# Altium project Fungnator.PrjPcb
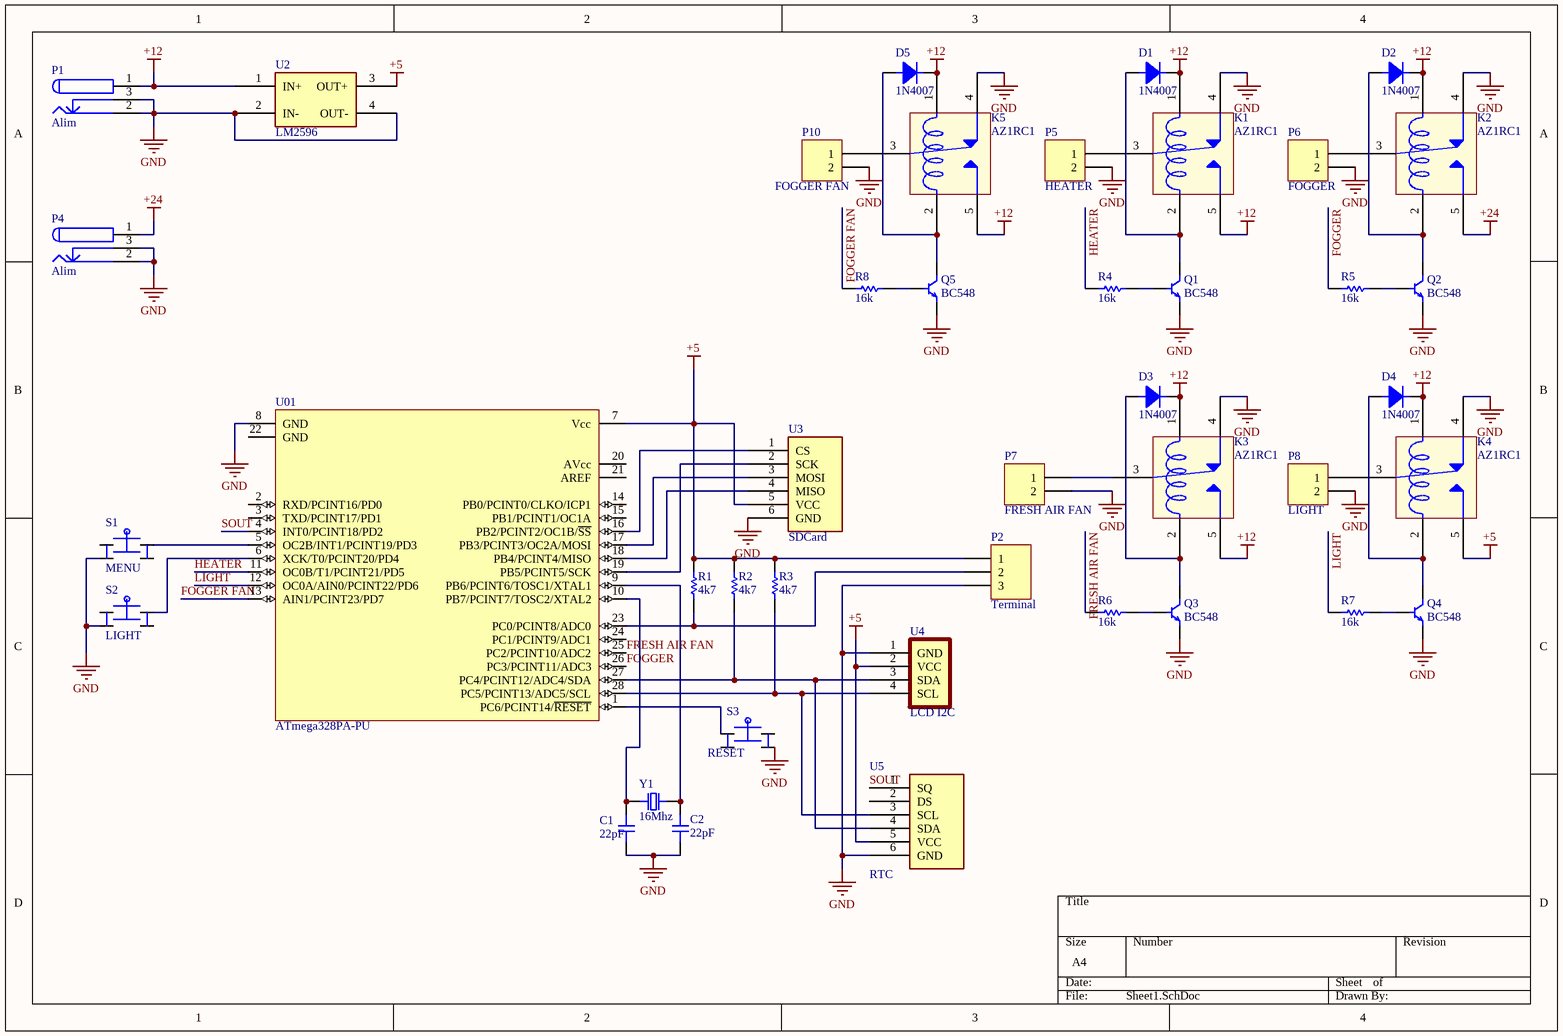
[diagram p0: Sheet1.SchDoc]
1 sheet, 42 parts. Net scope: global (net labels, ports and power ports of the same name join across sheets).
Board file: PCB1.PcbDoc

## Sheet Sheet1.SchDoc
size A4

### Parts
C1  22pF  [C100-200-100]
C2  22pF  [C100-200-100]
D1  1N4007  [DO-41-Plastic]
D2  1N4007  [DO-41-Plastic]
D3  1N4007  [DO-41-Plastic]
D4  1N4007  [DO-41-Plastic]
D5  1N4007  [DO-41-Plastic]
K1  AZ1RC1  [Relay-A]
K2  AZ1RC1  [Relay-A]
K3  AZ1RC1  [Relay-A]
K4  AZ1RC1  [Relay-A]
K5  AZ1RC1  [Relay-A]
P1  Alim  [J4-DC-005]
P2  Terminal  [KRE_3]
P4  Alim  [J4-DC-005]
P5  HEATER  [KRE_2]
P6  FOGGER  [KRE_2]
P7  FRESH AIR FAN  [KRE_2]
P8  LIGHT  [KRE_2]
P10  FOGGER FAN  [KRE_2]
Q1  BC548  [TO-92/CBE]
Q2  BC548  [TO-92/CBE]
Q3  BC548  [TO-92/CBE]
Q4  BC548  [TO-92/CBE]
Q5  BC548  [TO-92/CBE]
R1  4k7  [R400-2.0mm]
R2  4k7  [R400-2.0mm]
R3  4k7  [R400-2.0mm]
R4  16k  [R400-2.0mm]
R5  16k  [R400-2.0mm]
R6  16k  [R400-2.0mm]
R7  16k  [R400-2.0mm]
R8  16k  [R400-2.0mm]
S1  MENU  [DTS-6.0mm-6.0mm-THT]
S2  LIGHT  [DTS-6.0mm-6.0mm-THT]
S3  RESET  [DTS-6.0mm-6.0mm-THT]
U01  ATmega328PA-PU  [DIP28-300(100)]
U2  LM2596  [LM2596]
U3  SDCard  [SDCard]
U4  LCD I2C  [LCD_I2C]
U5  RTC  [RTC]
Y1  16Mhz  [HC49-US-THT]

### Nets
+5: K4.5 P2.1 R1.2 R2.2 R3.2 U01.7(Vcc) U2.3(OUT+) U3.5(VCC) U4.2(VCC) U5.5(VCC)
+12: D1.K D2.K D3.K D4.K D5.K K1.1 K1.5 K2.1 K3.1 K3.5 K4.1 K5.1 K5.5 P1.1 U2.1(IN+)
+24: K2.5 P4.1
GND: C1.1 C2.1 K1.4 K2.4 K3.4 K4.4 K5.4 P1.2 P1.3 P2.3 P4.2 P4.3 P5.2 P6.2 P7.2 P8.2 P10.2 Q1.E Q2.E Q3.E Q4.E Q5.E S1.2 S2.2 S3.4 U01.8(GND) U2.2(IN-) U2.4(OUT-) U3.6(GND) U4.1(GND) U5.6(GND)
FOGGER: R5.1 U01.26(PC3/PCINT11/ADC3)
FOGGER FAN: R8.1 U01.13(AIN1/PCINT23/PD7)
FRESH AIR FAN: R6.1 U01.25(PC2/PCINT10/ADC2)
HEATER: R4.1 U01.11(OC0B/T1/PCINT21/PD5)
LIGHT: R7.1 U01.12(OC0A/AIN0/PCINT22/PD6)
SOUT: U01.4(INT0/PCINT18/PD2) U5.1(SQ)
NetC1_2: C1.2 U01.10(PB7/PCINT7/TOSC2/XTAL2) Y1.2
NetC2_2: C2.2 U01.9(PB6/PCINT6/TOSC1/XTAL1) Y1.1
NetD1_A: D1.A K1.2 Q1.C
NetD2_A: D2.A K2.2 Q2.C
NetD3_A: D3.A K3.2 Q3.C
NetD4_A: D4.A K4.2 Q4.C
NetD5_A: D5.A K5.2 Q5.C
NetK1_3: K1.3 P5.1
NetK2_3: K2.3 P6.1
NetK3_3: K3.3 P7.1
NetK4_3: K4.3 P8.1
NetK5_3: K5.3 P10.1
NetP2_2: P2.2 R1.1 U01.23(PC0/PCINT8/ADC0)
NetQ1_B: Q1.B R4.2
NetQ2_B: Q2.B R5.2
NetQ3_B: Q3.B R6.2
NetQ4_B: Q4.B R7.2
NetQ5_B: Q5.B R8.2
NetR2_1: R2.1 U01.27(PC4/PCINT12/ADC4/SDA) U4.3(SDA) U5.4(SDA)
NetR3_1: R3.1 U01.28(PC5/PCINT13/ADC5/SCL) U4.4(SCL) U5.3(SCL)
NetS1_3: S1.3 U01.5(OC2B/INT1/PCINT19/PD3)
NetS2_3: S2.3 U01.6(XCK/T0/PCINT20/PD4)
NetS3_1: S3.1 U01.1(PC6/PCINT14/~{RESET})
NetU01_16: U01.16(PB2/PCINT2/OC1B/~{SS}) U3.1(CS)
NetU01_17: U01.17(PB3/PCINT3/OC2A/MOSI) U3.3(MOSI)
NetU01_18: U01.18(PB4/PCINT4/MISO) U3.4(MISO)
NetU01_19: U01.19(PB5/PCINT5/SCK) U3.2(SCK)

Not connected (* = marked no-connect by the designer): S1 1 4; S2 1 4; S3 2 3; U01 2(RXD/PCINT16/PD0) 3(TXD/PCINT17/PD1) 14(PB0/PCINT0/CLKO/ICP1) 15(PB1/PCINT1/OC1A) 20(AVcc) 21(AREF) 22(GND) 24(PC1/PCINT9/ADC1); U5 2(DS)

### Library data of the parts
C1 C2 = Capacitor: Voltage: 100 V; Published: 8-Jun-2000; LatestRevisionDate: 17-Jul-2002; LatestRevisionNote: Re-released for DXP Platform.; PackageReference: RAD-0.3; Publisher: Altium Limited
D1-D5 = 1N4007: General Purpose Rectifier; Peak Repetitive Reverse Voltage (Vrrm): 1000 V; Forward Current (If): 1 A; Non-Repetitive Peak Forward Surge Current (Ifsm): 30 A; Forward Voltage (Vf): 1.1 V; Reverse Current (Ir): 5 uA; Total Capacitance (Ct): 15 pF
K1-K5 = AZ1RC1: Miniature Relay, 10 A, 6 Vdc, 250 Vac; Maximum Switching Voltage (AC): 250 V; Maximum Switching Voltage (DC): 30 V; Maximum Switching Current: 10 A; Coil Nominal Voltage (DC): 6 V
P1 P4 = Jack_J4: Jack J4
P2 = KRE_3: Terminal Block 1x3
P5-P8 P10 = KRE_2: Terminal Block 1x2
Q1-Q5 = BC548: NPN Epitaxial Silicon Transistor; Complementary Part: BC558; Collector-Base Voltage (Vcb): 30 V; Emitter-Base Voltage (Veb): 5 V; Collector Current (Ic): 100 mA; Total Power Dissipation (Ptot): 500 mW; DC Current Gain Min (hfe): 110; DC Current Gain Max (hfe): 800; Transition Frequency (fT): 300 MHz; Collector-Emitter Voltage (Vce): 30 V
R1-R8 = Resistor: Tolerance: 5%; Power: 1/4 W; Published: 8-Jun-2000; LatestRevisionDate: 17-Jul-2002; LatestRevisionNote: Re-released for DXP Platform.; PackageReference: AXIAL-0.3; Publisher: Altium Limited
S1-S3 = PushButton_4: Tactile Switch SPST 4 pins
U01 = ATmega328PA-PU: 8-bit AVR Microcontroller with 32 KB In-System Programmable Flash; Flash Memory: 32 KB; EEPROM Memory: 1 KB; SRAM Memory: 2 KB; Timer 8 bits: 2; Timer 16 bits: 1; PWM Channel: 6; I/O Pins: 23; Supply Voltage (Vdd): 1.8 - 5.5 V; Clock Frequency: 0 - 20 MHz; Debug: debugWire; ADC Channel: 6; Serial USART: 1; Serial SPI: 1; Serial I2C: 1; Analog Comparator: 1
U4 = LCD_I2C
Y1 = Crystal